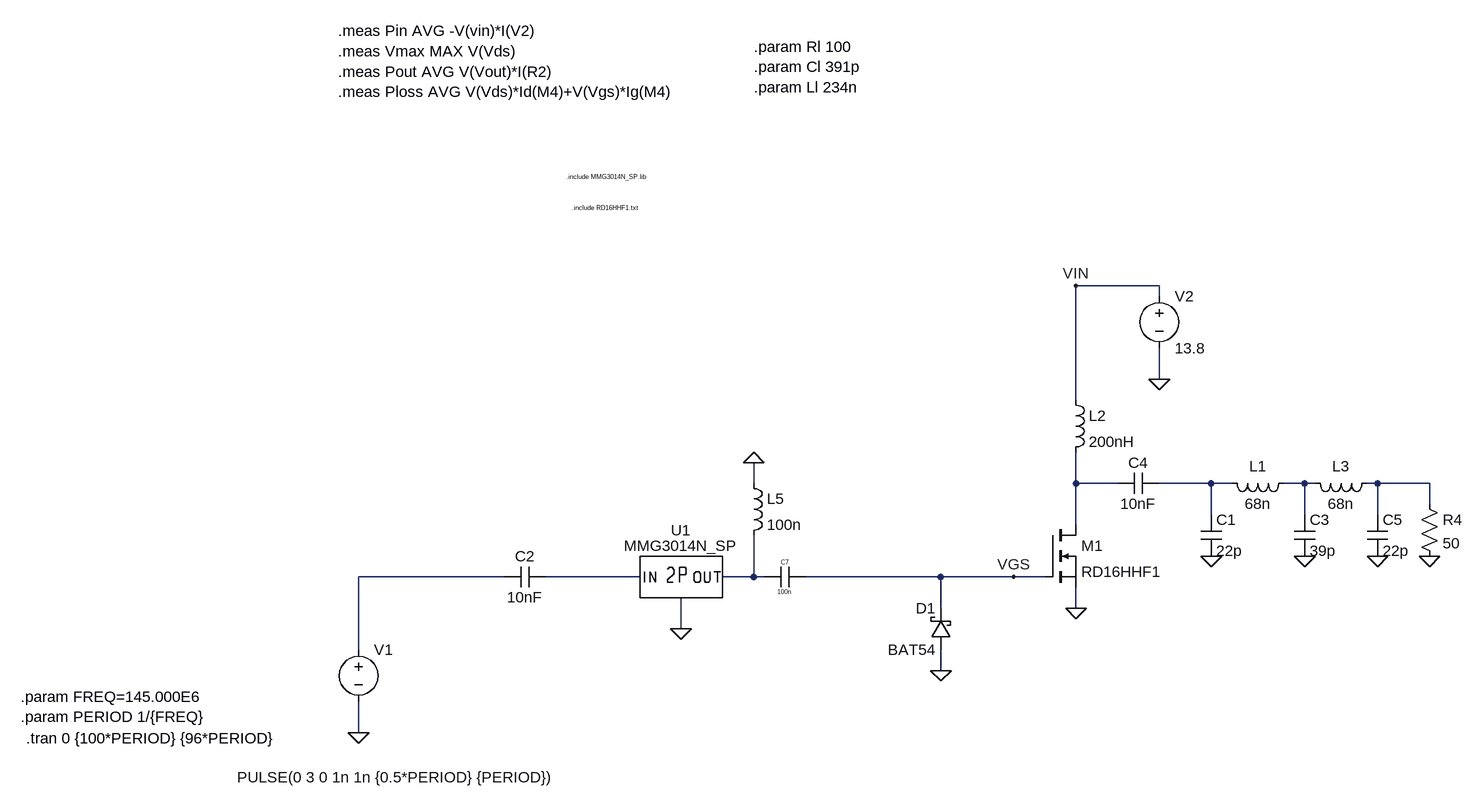
[diagram p0: schematic VHF-Amp-Rough-Sim.asc]
VHF-Amp-Rough-Sim.asc, the LTspice schematic file:
Version 4.1
SHEET 1 3300 912
WIRE 416 -240 288 -240
WIRE 416 -224 416 -240
WIRE 416 -96 416 -144
WIRE 288 -64 288 -240
WIRE -208 64 -208 32
WIRE 288 64 288 16
WIRE 352 64 288 64
WIRE 496 64 416 64
WIRE 528 64 496 64
WIRE 640 64 608 64
WIRE 656 64 640 64
WIRE 752 64 736 64
WIRE 832 64 752 64
WIRE 832 96 832 64
WIRE 496 112 496 64
WIRE 640 112 640 64
WIRE 752 112 752 64
WIRE 288 128 288 64
WIRE -592 208 -816 208
WIRE -384 208 -528 208
WIRE -208 208 -208 144
WIRE -208 208 -256 208
WIRE -192 208 -208 208
WIRE 80 208 -128 208
WIRE 192 208 80 208
WIRE 240 208 192 208
WIRE 80 256 80 208
WIRE 288 256 288 224
WIRE -320 288 -320 240
WIRE -816 320 -816 208
WIRE 80 352 80 320
WIRE -816 448 -816 400
FLAG 288 256 0
FLAG 416 -96 0
FLAG -816 448 0
FLAG 288 -240 VIN
FLAG 192 208 VGS
FLAG 832 176 0
FLAG -320 288 0
FLAG -208 32 0
FLAG 80 352 0
FLAG 752 176 0
FLAG 640 176 0
FLAG 496 176 0
SYMBOL voltage -816 304 R0
WINDOW 123 0 0 Left 0
WINDOW 39 0 0 Left 0
WINDOW 3 -187 212 Left 2
SYMATTR Value PULSE(0 3 0 1n 1n {0.5*PERIOD} {PERIOD})
SYMATTR InstName V1
SYMBOL voltage 416 -240 R0
WINDOW 123 0 0 Left 0
WINDOW 39 0 0 Left 0
SYMATTR InstName V2
SYMATTR Value 13.8
SYMBOL cap -528 192 R90
WINDOW 0 0 32 VBottom 2
WINDOW 3 32 32 VTop 2
SYMATTR InstName C2
SYMATTR Value 10nF
SYMBOL ind 272 -80 R0
SYMATTR InstName L2
SYMATTR Value 200nH
SYMBOL cap 352 80 R270
WINDOW 0 32 32 VTop 2
WINDOW 3 0 32 VBottom 2
SYMATTR InstName C4
SYMATTR Value 10nF
SYMBOL res 816 80 R0
SYMATTR InstName R4
SYMATTR Value 50
SYMBOL S2PORT -320 208 R0
SYMATTR Value MMG3014N_SP
SYMATTR InstName U1
SYMBOL cap -192 224 R270
WINDOW 0 32 32 VTop 0
WINDOW 3 0 32 VBottom 0
SYMATTR InstName C7
SYMATTR Value 100n
SYMBOL ind -224 48 R0
SYMATTR InstName L5
SYMATTR Value 100n
SYMBOL schottky 96 320 R180
WINDOW 0 24 64 Left 2
WINDOW 3 24 0 Left 2
SYMATTR InstName D1
SYMATTR Value BAT54
SYMATTR Description Diode
SYMATTR Type diode
SYMBOL nmos 240 128 R0
SYMATTR InstName M1
SYMATTR Value RD16HHF1
SYMBOL Cap 480 112 R0
SYMATTR InstName C1
SYMATTR Value 22p
SYMBOL Cap 624 112 R0
SYMATTR InstName C3
SYMATTR Value 39p
SYMBOL Cap 736 112 R0
SYMATTR InstName C5
SYMATTR Value 22p
SYMBOL ind 624 48 R90
WINDOW 0 5 56 VBottom 2
WINDOW 3 32 56 VTop 2
SYMATTR InstName L1
SYMATTR Value 68n
SYMBOL ind 752 48 R90
WINDOW 0 5 56 VBottom 2
WINDOW 3 32 56 VTop 2
SYMATTR InstName L3
SYMATTR Value 68n
TEXT -1336 392 Left 2 !.param FREQ=145.000E6\n.param PERIOD 1/{FREQ}
TEXT -1328 456 Left 2 !.tran 0 {100*PERIOD} {96*PERIOD}
TEXT -848 -632 Left 2 !.meas Pin AVG -V(vin)*I(V2)\n.meas Vmax MAX V(Vds)\n.meas Pout AVG V(Vout)*I(R2)\n.meas Ploss AVG V(Vds)*Id(M4)+V(Vgs)*Ig(M4)
TEXT -208 -608 Left 2 !.param Rl 100\n.param Cl 391p\n.param Ll 234n
TEXT -496 -408 Left 0 !.include MMG3014N_SP.lib
TEXT -488 -360 Left 0 !.include RD16HHF1.txt

The netlist it stands for:
* VHF-Amp-Rough-Sim.asc
V1 N005 0 PULSE(0 3 0 1n 1n {0.5*PERIOD} {PERIOD})
V2 VIN 0 13.8
C2 N006 N005 10nF
L2 VIN N001 200nH
C4 N001 N002 10nF
R4 N004 0 50
X§U1 N006 N007 0 MMG3014N_SP  ; pins 1 2 3
C7 N007 VGS 100n
L5 0 N007 100n
D1 0 VGS BAT54
M1 N001 VGS 0 0 RD16HHF1
C1 N002 0 22p
C3 N003 0 39p
C5 N004 0 22p
L1 N003 N002 68n
L3 N004 N003 68n
.model D D
.lib standard.dio
.model NMOS NMOS
.model PMOS PMOS
.lib standard.mos
.param FREQ=145.000E6
.param PERIOD 1/{FREQ}
.tran 0 {100*PERIOD} {96*PERIOD}
.meas Pin AVG -V(vin)*I(V2)
.meas Vmax MAX V(Vds)
.meas Pout AVG V(Vout)*I(R2)
.meas Ploss AVG V(Vds)*Id(M4)+V(Vgs)*Ig(M4)
.param Rl 100
.param Cl 391p
.param Ll 234n
.include MMG3014N_SP.lib
.include RD16HHF1.txt
.backanno
.end